# Altium schematic sheet analog_input.SchDoc
size A3; DocumentNumber: 3; SheetNumber: 3; SheetTotal: 3
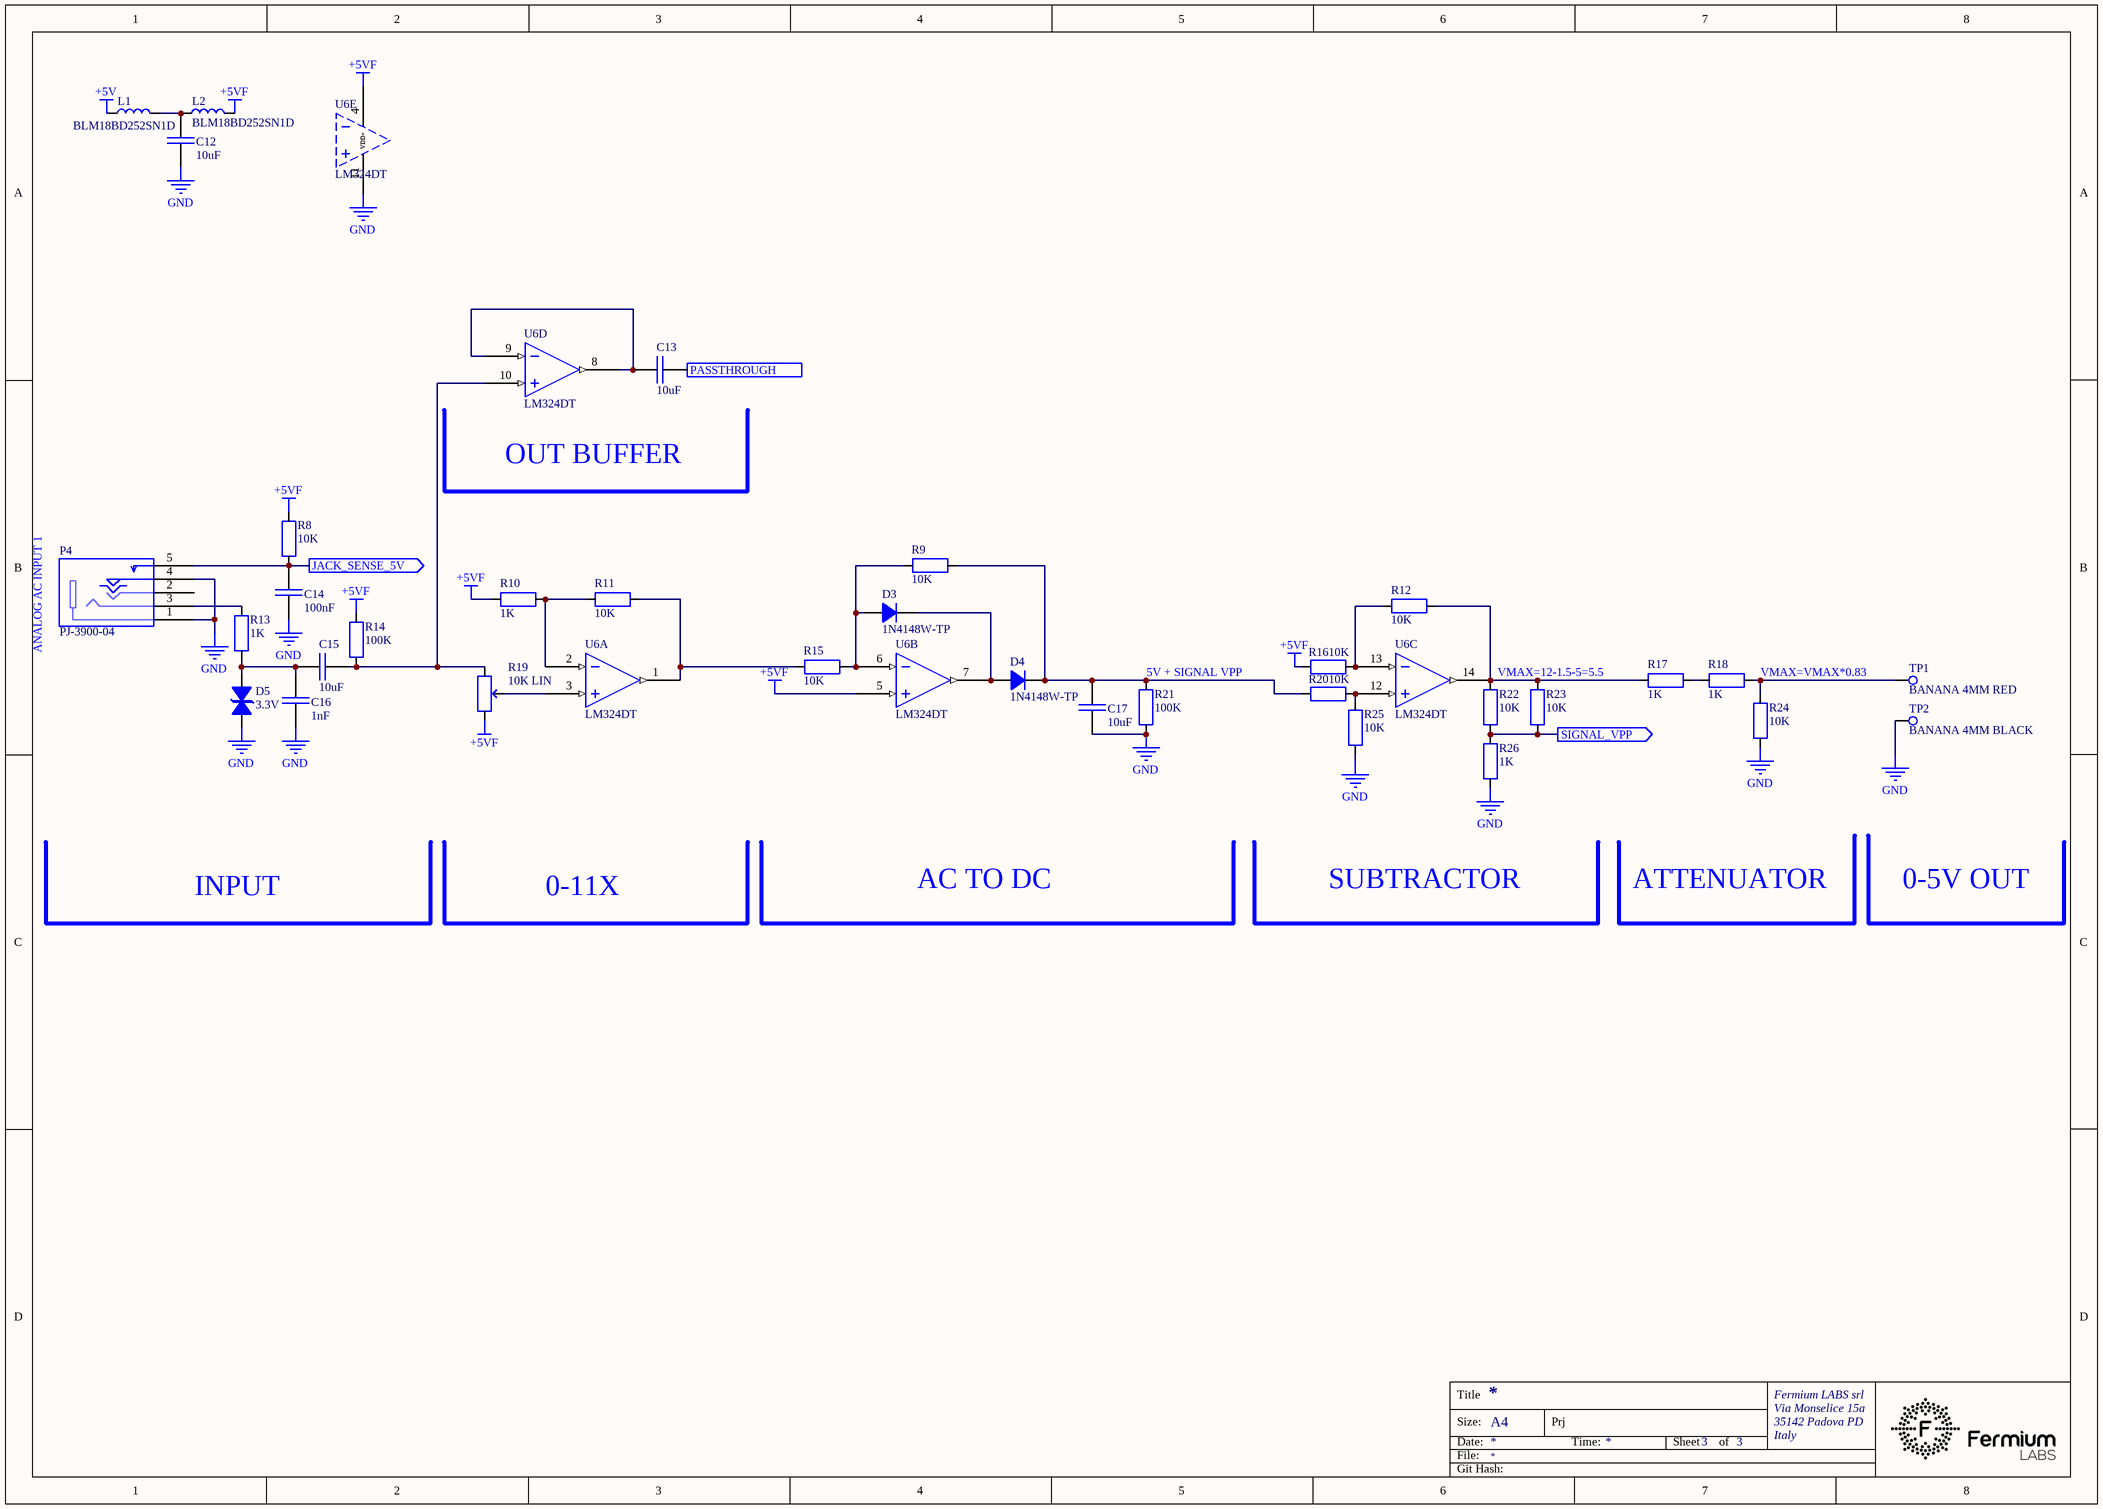
[diagram p0: analog_input.SchDoc]

## Parts
C12  10uF  [CAP 0805_2012]
C13  10uF  [CAP 0805_2012]
C14  100nF  [CAP 0603_1608]
C15  10uF  [CAP 0805_2012]
C16  1nF  [CAP 0603_1608]
C17  10uF  [CAP 0805_2012]
D3  1N4148W-TP  [SOD-123]
D4  1N4148W-TP  [SOD-123]
D5  3.3V  [SOD523F]
L1  BLM18BD252SN1D  [FER 0603_1608]
L2  BLM18BD252SN1D  [FER 0603_1608]
P4  PJ-3900-04  [7EF2B92C-0FC9-4C85-B662-5CEC65BFCCC4]
R8  10K  [RES 0603_1608]
R9  10K  [RES 0603_1608]
R10  1K  [RES 0603_1608]
R11  10K  [RES 0603_1608]
R12  10K  [RES 0603_1608]
R13  1K  [RES 0603_1608]
R14  100K  [RES 0603_1608]
R15  10K  [RES 0603_1608]
R16  10K  [RES 0603_1608]
R17  1K  [RES 0603_1608]
R18  1K  [RES 0603_1608]
R19  10K LIN
R20  10K  [RES 0603_1608]
R21  100K  [RES 0603_1608]
R22  10K  [RES 0603_1608]
R23  10K  [RES 0603_1608]
R24  10K  [RES 0603_1608]
R25  10K  [RES 0603_1608]
R26  1K  [RES 0603_1608]
TP1  BANANA 4MM RED  (no BOM)
TP2  BANANA 4MM BLACK  (no BOM)
U6  LM324DT  [34355DA5-B1DA-47C2-A88A-ECF82120A4F7]  (parts A,B,C,D,E of 5)

## Ports
JACK_SENSE_5V (out), PASSTHROUGH (out), SIGNAL_VPP (out)

## Nets
+5V: L1.1
+5VF: L2.2 R8.2 R10.2 R14.1 R16.2 R19.2 U6.4(VDD+) U6.5(IN+)
GND: C12.1 C14.1 C16.2 C17.2 D5.2 P4.1(GND) P4.4(AUX) R21.1 R24.2 R25.2 R26.2 TP2.1(TP) U6.11(VDD-)
JACK_SENSE_5V: C14.2 P4.5(AUX) R8.1 ; port JACK_SENSE_5V
PASSTHROUGH: C13.1 ; port PASSTHROUGH
SIGNAL_VPP: R22.2 R23.2 R26.1 ; port SIGNAL_VPP
NetC12_2: C12.2 L1.2 L2.1
NetC13_2: C13.2 U6.8(OUT) U6.9(IN-)
NetC15_1: C15.1 C16.1 D5.1 R13.1
NetC15_2: C15.2 R14.2 R19.1 U6.10(IN+)
NetC17_1: C17.1 D4.1(K) R9.1 R20.2 R21.2
NetD3_1: D3.1(K) D4.2(A) U6.7(OUT)
NetD3_2: D3.2(A) R9.2 R15.1 U6.6(IN-)
NetP4_3: P4.3(L) R13.2
NetR10_1: R10.1 R11.1 U6.2(IN-)
NetR11_2: R11.2 R15.2 U6.1(OUT)
NetR12_1: R12.1 R17.1 R22.1 R23.1 U6.14(OUT)
NetR12_2: R12.2 R16.1 U6.13(IN-)
NetR17_2: R17.2 R18.1
NetR18_2: R18.2 R24.1 TP1.1(TP)
NetR19_3: R19.3 U6.3(IN+)
NetR20_1: R20.1 R25.1 U6.12(IN+)

Not connected (* = marked no-connect by the designer): P4 2(R)

## Notes on the sheet
- OUT BUFFER
- ANALOG AC INPUT 1
- (near R21) 5V + SIGNAL VPP
- VMAX=12-1.5-5=5.5
- VMAX=VMAX*0.83
- INPUT
- 0-11X
- AC TO DC
- SUBTRACTOR
- ATTENUATOR
- 0-5V OUT
- Title
- Fermium LABS srl
- Size:
- Date:
- File:
- A4
- Prj
- Time:
- Sheet
- of
- Via Monselice 15a
- 35142 Padova PD
- Italy
- Git Hash:

## Library data of the parts
C12 C13 C15 C17 = 1ffbe5a9-0884-4740-bdad-20a6a98400e6: CAP SMD MLCC 10uF 25V 0805 X5R; Manufacturer 1: Samsung Electro-Mechanics; Manufacturer Part Number 1: CL21A106KAYNNNE; id: 14779; Part Number: 1ffbe5a9-0884-4740-bdad-20a6a98400e6; ComponentLink1Description: Datasheet; ComponentLink1URL: http://localhost:8080/static/files/Samsung-Electro-Mechanics-CL21A106KAYNNNE_C158502019-03-10_213827.610739.pdf?Samsung-Electro-Mechanics-CL21A106KAYNNNE_C15850.pdf; Value: 10uF; Manufacturer 2: Murata; Manufacturer Part Number 2: GRM21BR61E106KA73L
C14 = 02841f84-ac15-41b5-9e17-915f8f067828: CAP SMD MLCC 100nF 25V 0603 X7R; Manufacturer 1: Samsung Electro-Mechanics; Manufacturer Part Number 1: CL10B104KA8NNNC; id: 14784; Part Number: 02841f84-ac15-41b5-9e17-915f8f067828; ComponentLink1Description: Datasheet; ComponentLink1URL: http://localhost:8080/static/files/Samsung-Electro-Mechanics-CL10B104KA8NNNC_C15902019-03-10_215548.826887.pdf?Samsung-Electro-Mechanics-CL10B104KA8NNNC_C1590.pdf; Value: 100nF
C16 = 0eca2548-3630-4fea-a3d5-94248c1cae74: CAP SMD MLCC 1nF 50V 0603 X7R; Manufacturer 1: Samsung Electro-Mechanics; Manufacturer Part Number 1: CL10B102KB8NNNC; id: 14785; Part Number: 0eca2548-3630-4fea-a3d5-94248c1cae74; ComponentLink1Description: Datasheet; ComponentLink1URL: http://localhost:8080/static/files/Samsung-Electro-Mechanics-CL10B102KB8NNNC_C1588_12019-03-10_215732.131818.pdf?Samsung-Electro-Mechanics-CL10B102KB8NNNC_C1588 (1).pdf; Value: 1nF
D3 D4 = 5e920700-75df-48e3-84dd-8f9f777caed8: DIODE SMD 100V 150mA 1.5Vf SOD-123 4148; Manufacturer 1: MCC; id: 14795; Part Number: 5e920700-75df-48e3-84dd-8f9f777caed8; ComponentLink1Description: Datasheet; ComponentLink1URL: http://localhost:8080/static/files/Micro-Commercial-Components-MCC-1N4148W-TP_C779782019-04-06_215019.428643.pdf?Micro-Commercial-Components-MCC-1N4148W-TP_C77978.pdf; Manufacturer Part Number 1: 1N4148W-TP
D5 = d6266fd0-7428-4fb9-a062-338cdce926fd: DIODE SMD TVS 3.3V BIDIRECTIONAL SOD-523; Manufacturer 1: Born Semiconductor; Manufacturer Part Number 1: PESD3V3S1BA-N; id: 14798; Part Number: d6266fd0-7428-4fb9-a062-338cdce926fd; ComponentLink1Description: Datasheet; ComponentLink1URL: http://localhost:8080/static/files/Bourne-Semicon-Shenzhen-PESD3V3S1BA-N_C3160372019-04-07_002431.794112.pdf?Bourne-Semicon-Shenzhen-PESD3V3S1BA-N_C316037.pdf; Value: 3.3V
L1 L2 = c9e30ae8-9d5b-4135-a079-b1147da846d8: FER SMD CHIP 0603 400mA 2.5K@100MHz 500mOhm; Manufacturer 1: Murata; id: 14786; Part Number: c9e30ae8-9d5b-4135-a079-b1147da846d8; ComponentLink1Description: Datasheet; ComponentLink1URL: http://localhost:8080/static/files/Murata-Electronics-BLM18AG102SN1D_C858242019-03-10_220021.186607.pdf?Murata-Electronics-BLM18AG102SN1D_C85824.pdf; Manufacturer Part Number 1: BLM18BD252SN1D
P4 = 80507a24-5d7c-4cf5-953e-f54832d54564: CONN THT 3.5mm AUDIO STEREO AUX SWITCH; Manufacturer 1: HRO Electronics; id: 14793; Part Number: 80507a24-5d7c-4cf5-953e-f54832d54564; ComponentLink1Description: Datasheet; ComponentLink1URL: http://localhost:8080/static/files/Korean-Hroparts-Elec-PJ-3900-04_C1518392019-04-10_231144.687617.pdf?Korean-Hroparts-Elec-PJ-3900-04_C151839.pdf; Manufacturer Part Number 1: PJ-3900-04
R8 R9 R11 R12 R15 R16 R20 R22-R25 = 93242766-ba1d-462d-b58f-ce1dfc4129c8: RES SMD 10K OHM 1% 1/10W 0603; Manufacturer 1: Yageo; Manufacturer Part Number 1: RC0603FR-0710KL; id: 12101; Part Number: 93242766-ba1d-462d-b58f-ce1dfc4129c8; Value: 10K
R10 R13 R17 R18 R26 = a678220f-9e9d-4863-a833-9993504f723c: RES SMD 1K OHM 1% 1/10W 0603; Manufacturer 1: Yageo; Manufacturer Part Number 1: RC0603FR-071KL; id: 14794; Part Number: a678220f-9e9d-4863-a833-9993504f723c; Value: 1K
R14 R21 = 76af10b3-9d85-4b5c-a2d6-26cc74f432f7: RES SMD 100K OHM 1% 1/10W 0603; Manufacturer 1: Yageo; Manufacturer Part Number 1: RC0603FR-07100KL; id: 12746; Part Number: 76af10b3-9d85-4b5c-a2d6-26cc74f432f7; Value: 100K
R19 = 3df905ea-1e80-4add-859d-a36edd7f106c: POT 10K LIN; Manufacturer 1: ALPS; Manufacturer Part Number 1: RK11K1130A07; id: 14828; Part Number: 3df905ea-1e80-4add-859d-a36edd7f106c; ComponentLink1Description: Datasheet; ComponentLink1URL: http://localhost:8080/static/files/2019-08-09_191742.103177.pdf?+.pdf; Value: 10K LIN
TP1 = 3b84d3c9-1de5-4004-b768-3958a778153b: CONN BANANA SOCKET 4MM RED; Manufacturer 1: Changzhou Amass Elec; Manufacturer Part Number 1: 24.247.1; id: 14826; Part Number: 3b84d3c9-1de5-4004-b768-3958a778153b; ComponentLink1Description: Datasheet; ComponentLink1URL: http://localhost:8080/static/files/Changzhou-Amass-Elec-24-247-1_C1062732019-08-09_175257.693472.pdf?Changzhou-Amass-Elec-24-247-1_C106273.pdf
TP2 = 80ef162c-aaff-440a-80ad-5900ce15f9c1: CONN BANANA SOCKET 4MM BLACK; Manufacturer 1: Changzhou Amass Elec; Manufacturer Part Number 1: 24.247.2; id: 14827; Part Number: 80ef162c-aaff-440a-80ad-5900ce15f9c1
U6 = 21a85167-c328-42f7-a52e-365842c6dad3: IC SMD OPAMP LM324DT SO-14; Manufacturer 1: ST Microelectronics; id: 14792; Part Number: 21a85167-c328-42f7-a52e-365842c6dad3; ComponentLink1Description: Datasheet; ComponentLink1URL: http://localhost:8080/static/files/STMicroelectronics-LM324DT_C710352019-04-06_191500.254110.pdf?STMicroelectronics-LM324DT_C71035.pdf; Manufacturer Part Number 1: LM324DT